# EasyEDA Pro project ProPrj_四轴3.0_2025-12-06.epro, schematic 5V升压(2-5V -> 5V）
Board Name: 5V升压(2-5V -> 5V）; Create Date: 2025-08-22; Page Name: P1; Project Name: 5V升压(2-5V -> 5V）; Schematic Name: 5V升压(2-5V -> 5V）; Update Date: 2025-08-22; Company: 嘉立创EDA; Page Size: A4; Version: V1.0
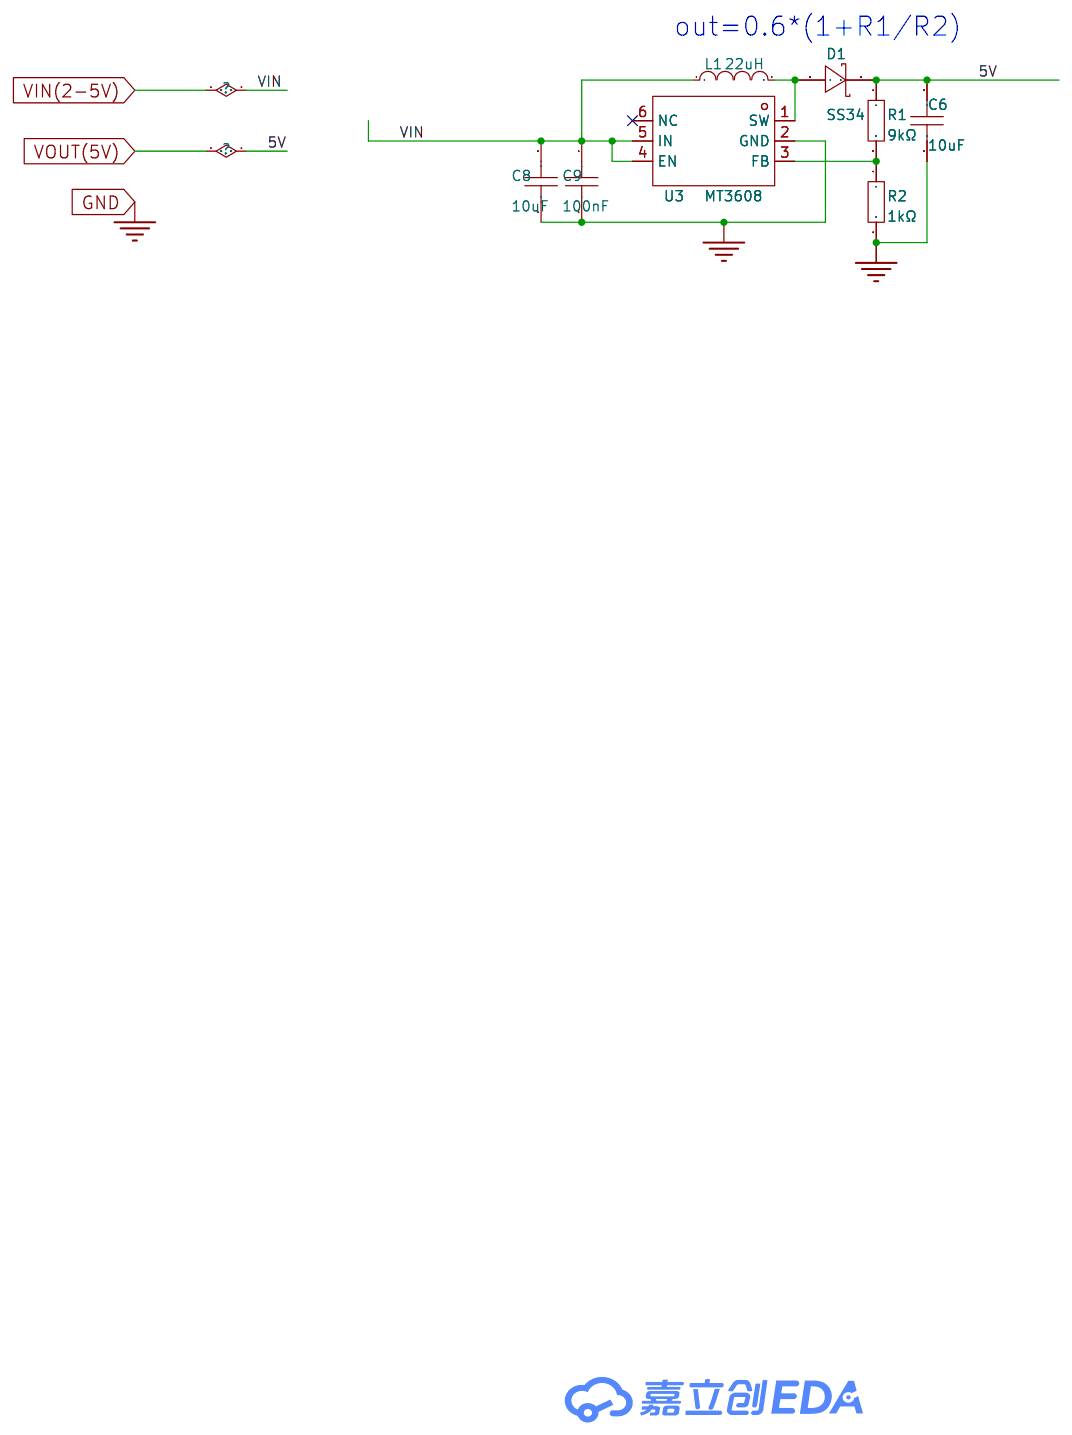
[diagram p1: schematic sheet]

## Parts
C6  10uF  [C0603]
C8  10uF  [C0603]
C9  100nF  [C0603]
D1  SS34  [SMA_L4.3-W2.6-LS5.2-RD]
L1  22uH  [IND-SMD_L7.1-W6.6]
R1  9kΩ  [R0603]
R2  1kΩ  [R0603]
U3  MT3608  [SOT-23-6_L2.9-W1.6-P0.95-LS2.8-BL]

## Library data of the parts
C6 C8 = CGA0603X5R106K100JT: 容值:10uF;精度:±10%;额定电压:10V;温度系数:X5R;; LCSC Part Name: 10uF ±10% 10V; Supplier Part: C6119842; Manufacturer: HRE(芯声); Supplier Footprint: 0603; JLCPCB Part Class: Extended Part; Supplier: LCSC; Tolerance: ±10%; Voltage Rating: 10V; Temperature Coefficient: X5R
C9 = CGA0603X7R104K500JT: 容值:100nF;精度:±10%;额定电压:50V;温度系数:X7R;; LCSC Part Name: 100nF ±10% 50V; Supplier Part: C6119867; Manufacturer: HRE(芯声); Supplier Footprint: 0603; JLCPCB Part Class: Extended Part; Datasheet: https://atta.szlcsc.com/upload/public/pdf/source/20250103/C44077DA9E7B3EFAE02F22B6D3D1CBC9.pdf; Supplier: LCSC; Tolerance: ±10%; Voltage Rating: 50V; Temperature Coefficient: X7R
D1 = SS34_C8678: 二极管配置:独立式;正向压降(Vf):550mV@3A;直流反向耐压(Vr):40V;整流电流:3A;; LCSC Part Name: 电压:40V 电流:3A; Supplier Part: C8678; Manufacturer: MDD(辰达半导体); Supplier Footprint: SMA(DO-214AC); Datasheet: https://atta.szlcsc.com/upload/public/pdf/source/20230314/A80AE34493C69B89E2F4B1712F433538.pdf; Supplier: LCSC; Diode Configuration: 独立式; Forward Voltage (Vf@If): 550mV@3A; Reverse Voltage (Vr): 40V; Rectified Current: 3A; Reverse Leakage Current (Ir): 500uA@40V
L1 = YSPI0630A-220M: 电感值:22uH;精度:±20%;额定电流:3A;; LCSC Part Name: 22uH ±20%; Supplier Part: C497873; Manufacturer: YJYCOIN(益嘉源); Supplier Footprint: SMD,6.6x7.1mm; Datasheet: https://atta.szlcsc.com/upload/public/pdf/source/20200317/C497869_D09F597887D5FB8B541C5C98B400E286.pdf; Supplier: LCSC; Tolerance: ±20%; Rated Current: 3A; DC Resistance (DCR): 130mΩ
R1 = RTT039001FTP: 电阻类型:厚膜电阻;阻值:9kΩ;精度:±1%;功率:100mW;工作电压:75V;温度系数:±100ppm/℃;; LCSC Part Name: 厚膜电阻 9kΩ ±1% 100mW; Supplier Part: C166911; Manufacturer: RALEC(旺诠); Supplier Footprint: 0603; JLCPCB Part Class: Extended Part; Datasheet: https://item.szlcsc.com/datasheet/RTT039001FTP/178294.html; Supplier: LCSC; Type: 厚膜电阻; Tolerance: ±1%; Power(Watts): 100mW; Voltage-Supply(Max): 75V; Temperature Coefficient: ±100ppm/℃; Operating Temperature: -55℃~+155℃
R2 = 0603WAF1001T5E: 电阻类型:厚膜电阻;阻值:1kΩ;精度:±1%;功率:100mW;最大工作电压:75V;温度系数:±100ppm/℃;; LCSC Part Name: 1kΩ ±1% 100mW 厚膜电阻; Supplier Part: C21190; Manufacturer: UNI-ROYAL(厚声); Supplier Footprint: 0603; JLCPCB Part Class: Basic Part; Datasheet: https://atta.szlcsc.com/upload/public/pdf/source/20200306/C422600_1E6D84923E4A46A82E41ADD87F860B5C.pdf; Supplier: LCSC; Type: 厚膜电阻; Tolerance: ±1%; Power(Watts): 100mW; Overload Voltage (Max): 75V; Temperature Coefficient: ±100ppm/℃; Operating Temperature Range: -55℃~+155℃
U3 = MT3608: 功能类型:升压型;输入电压:2V~24V;输出电压:28V;输出电流(最大值):-;; Supplier Part: C84817; Manufacturer: 西安航天民芯; Supplier Footprint: SOT-23-6; JLCPCB Part Class: 扩展库; Datasheet: https://atta.szlcsc.com/upload/public/pdf/source/20161110/1478743351706.pdf; Supplier: LCSC; Function: 升压型; Input Voltage: 2V~24V; Output Voltage: 28V; Switching Frequency: 1.2MHz; Number of Outputs: 1; Topology: 升压式; Switch tube (built-in/external): 内置

## Nets
5V: C6.2 D1.1(K) R1.1
GND: C6.1 C8.1 C9.1 R2.2 U3.2(GND)
VIN: C8.2 C9.2 L1.1 U3.4(EN) U3.5(IN)
$1N551: D1.2(A) L1.2 U3.1(SW)
$1N553: R1.2 R2.1 U3.3(FB)

Not connected (* = marked no-connect by the designer): U3 6(NC)*

## Notes on the sheet
- out=0.6*(1+R1/R2)
